# EAGLE design MySensorMicro (EAGLE 7.3.0)
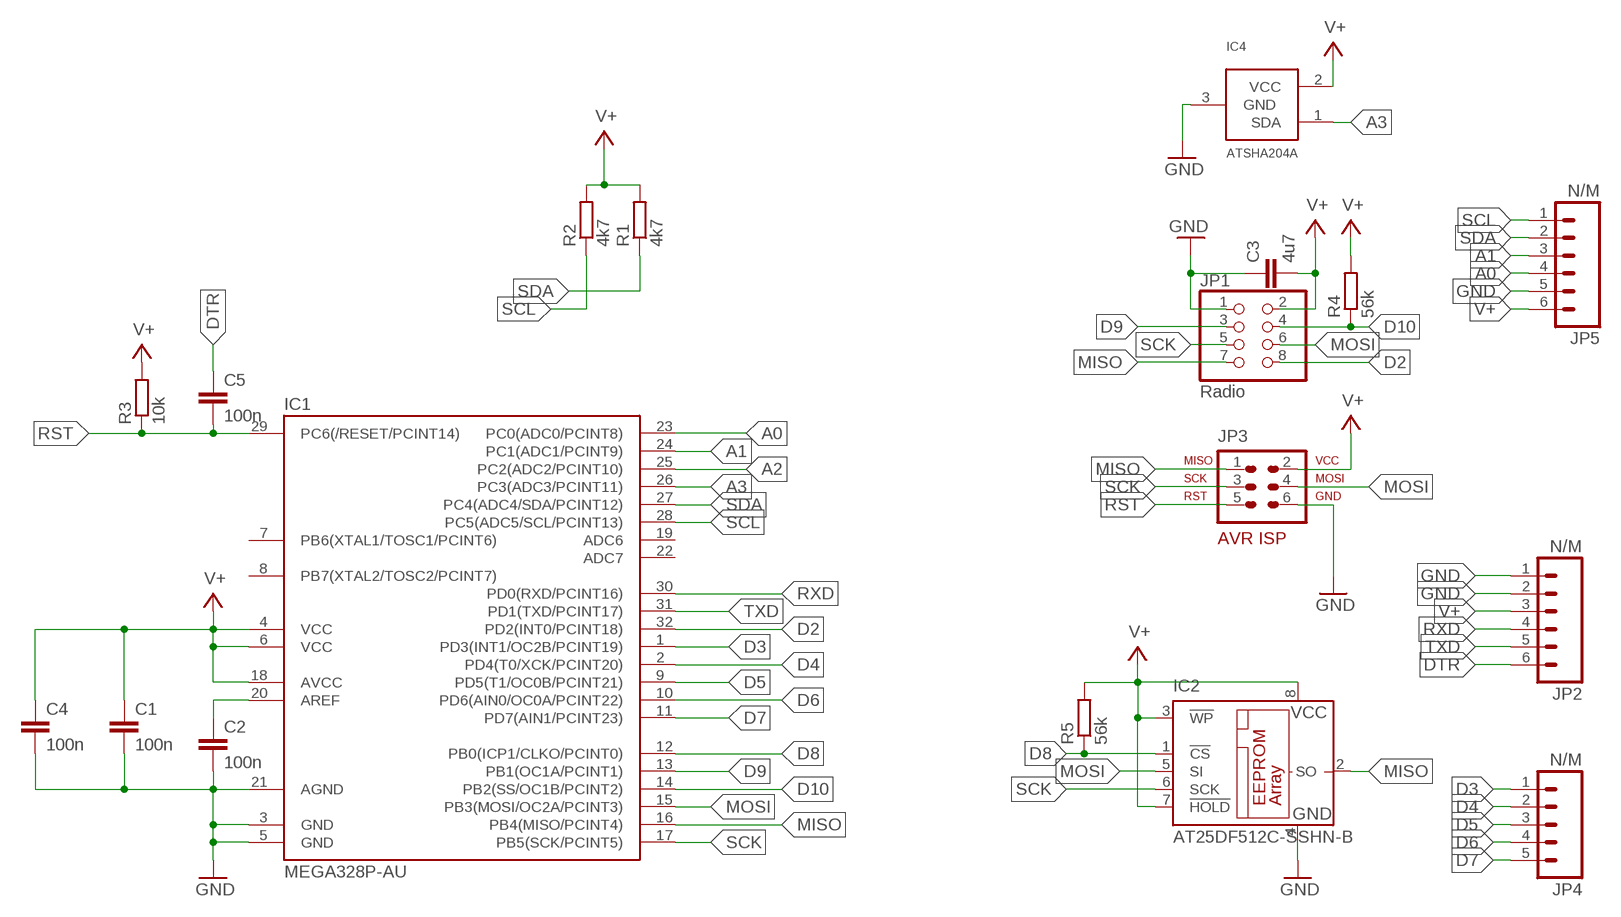
[diagram p0: schematic, sheet 1]

## Parts
C1  100n  C-EUC0603K  [C0603K]
C2  100n  C-EUC0603K  [C0603K]
C3  4u7  C-EUC0603K  [C0603K]
C4  100n  C-EUC0603K  [C0603K]
C5  100n  C-EUC0603K  [C0603K]
IC1  MEGA328P-AU  MEGA48/88/168-AU  [TQFP32-08]
IC2  AT25DF512C-SSHN-B  25AA080SN  [SO-08]
IC4  ATSHA204A  [SOT23]
JP1  Radio  PINHD-2X4  [2X04]
JP2  N/M  M06NO_SILK_FEMALE_PTH  [1X06_NO_SILK]
JP3  N/M  AVR-ISP-6VERT  [AVR-ISP-6]
JP4  N/M  M05NO_SILK  [1X05_NO_SILK]
JP5  N/M  M06NO_SILK_FEMALE_PTH  [1X06_NO_SILK]
R1  4k7  R-EU_R0603  [R0603]
R2  4k7  R-EU_R0603  [R0603]
R3  10k  R-EU_R0603  [R0603]
R4  56k  R-EU_R0603  [R0603]
R5  56k  R-EU_R0603  [R0603]

## Nets
A0: IC1.23(PC0(ADC0/PCINT8)) JP5.4
A1: IC1.24(PC1(ADC1/PCINT9)) JP5.3
A2: IC1.25(PC2(ADC2/PCINT10))
A3: IC1.26(PC3(ADC3/PCINT11)) IC4.1(SDA)
D2: IC1.32(PD2(INT0/PCINT18)) JP1.8
D3: IC1.1(PD3(INT1/OC2B/PCINT19)) JP4.1
D4: IC1.2(PD4(T0/XCK/PCINT20)) JP4.2
D5: IC1.9(PD5(T1/OC0B/PCINT21)) JP4.3
D6: IC1.10(PD6(AIN0/OC0A/PCINT22)) JP4.4
D7: IC1.11(PD7(AIN1/PCINT23)) JP4.5
D8: IC1.12(PB0(ICP1/CLKO/PCINT0)) IC2.1(!CS) R5.1
D9: IC1.13(PB1(OC1A/PCINT1)) JP1.3
D10: IC1.14(PB2(SS/OC1B/PCINT2)) JP1.4 R4.1
DTR: C5.1 JP2.6
GND [Power]: C1.2 C2.2 C3.1 C4.2 IC1.3(GND) IC1.5(GND) IC1.21(AGND) IC2.4(GND) IC4.3(GND) JP1.1 JP2.1 JP2.2 JP3.6 JP5.5
MISO: IC1.16(PB4(MISO/PCINT4)) IC2.2(SO) JP1.7 JP3.1
MOSI: IC1.15(PB3(MOSI/OC2A/PCINT3)) IC2.5(SI) JP1.6 JP3.4
N$4: C2.1 IC1.20(AREF)
RST: C5.2 IC1.29(PC6(/RESET/PCINT14)) JP3.5 R3.1
RXD: IC1.30(PD0(RXD/PCINT16)) JP2.4
SCK: IC1.17(PB5(SCK/PCINT5)) IC2.6(SCK) JP1.5 JP3.3
SCL: IC1.28(PC5(ADC5/SCL/PCINT13)) JP5.1 R2.1
SDA: IC1.27(PC4(ADC4/SDA/PCINT12)) JP5.2 R1.1
TXD: IC1.31(PD1(TXD/PCINT17)) JP2.5
V+ [Power]: C1.1 C3.2 C4.1 IC1.4(VCC) IC1.6(VCC) IC1.18(AVCC) IC2.3(!WP) IC2.7(!HOLD) IC2.8(VCC) IC4.2(VCC) JP1.2 JP2.3 JP3.2 JP5.6 R1.2 R2.2 R3.2 R4.2 R5.2
Unconnected: IC1.7(PB6(XTAL1/TOSC1/PCINT6)) IC1.8(PB7(XTAL2/TOSC2/PCINT7)) IC1.19(ADC6) IC1.22(ADC7)

## Library data of the parts
C1-C5 = resistor:C-EU: CAPACITOR, European symbol
IC1 = avr-7:MEGA48/88/168
IC2 = microchip:25*: Serial EEPROM 4K/ 8K , SPI bus; MF: MICROCHIP; MPN: 25AA080/SN; OC_FARNELL: 1816072; OC_NEWARK: 92C7351
IC4 = Sensor:ATSHA204A
JP1 = pinhead:PINHD-2X4: PIN HEADER
JP2 JP5 = SparkFun-Connectors:M06: Header 6 Standard 6-pin 0.1" header. Use with straight break away headers (SKU : PRT-00116), right angle break away headers (PRT-00553), swiss pins (PRT-00743), machine pins (PRT-00117), and female headers (PRT-00115). Molex polarized connector foot print use with SKU : PRT-08094 with associated crimp pins and housings. NOTES ON THE VARIANTS LOCK and LOCK_LONGPADS... This footprint was designed to help hold the alignment of a through-hole component (i.e. 6-pin header) while soldering it into place. You may notice that each hole has been shifted either up or down by 0.005 of an inch from it's more standard position (which is a perfectly straight line). This slight alteration caused the pins (the squares in the middle) to touch the edges of the holes. Because they are alternating, it causes a "brace" to hold the component in place. 0.005 has proven to be the perfect amount of "off-center" position when using our standard breakaway headers. Although looks a little odd when you look at the bare footprint, once you have a header in there, the alteration is very hard to notice. Also,if you push a header all the way into place, it is covered up entirely on the bottom side. This idea of altering the position of holes to aid alignment will be further integrated into the Sparkfun Library for other footprints. It can help hold any component with 3 or more connection pins.; PROD_ID: CONN-08437
JP3 = avr-7:AVR-ISP-6: AVR ISP-6 Serial Programming Header
JP4 = SparkFun-Connectors:M05: Header 5 Standard 5-pin 0.1" header. Use with straight break away headers (SKU : PRT-00116), right angle break away headers (PRT-00553), swiss pins (PRT-00743), machine pins (PRT-00117), and female headers (PRT-00115). Molex polarized connector foot print use with SKU : PRT-08230 with associated crimp pins and housings.
R1-R5 = resistor:R-EU_: RESISTOR, European symbol

## Net classes
0 default: width 0.203 mm
1 Power: width 0.406 mm

## Board
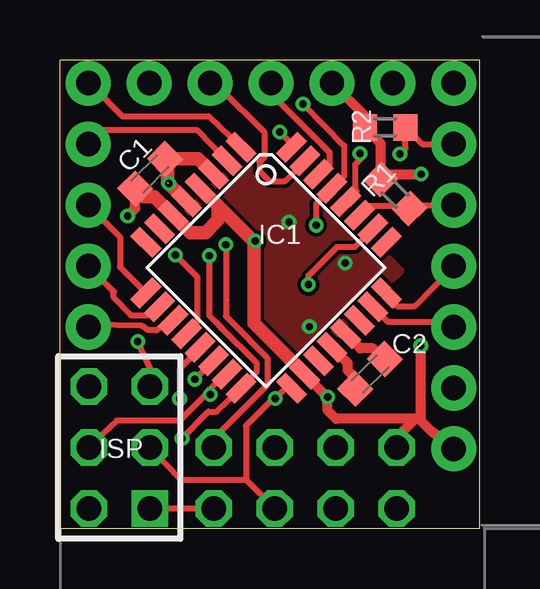
[diagram p1: board, top side]
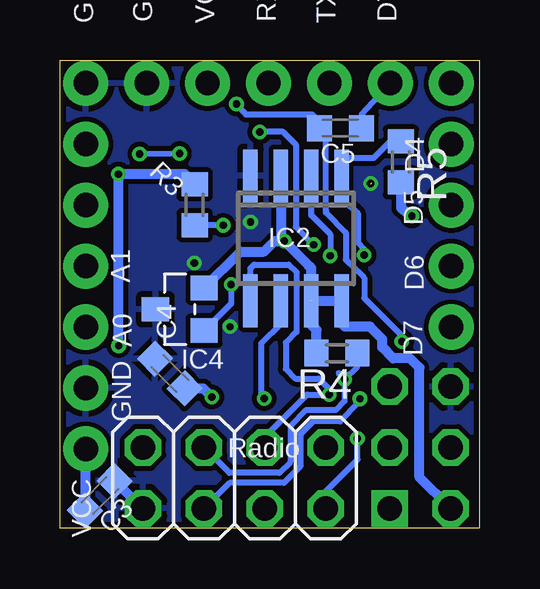
[diagram p2: board, bottom side, seen from below]

Size 17.5 x 19.5 mm. Coordinates in mm from the lower left corner, seen from the top.
Outline: 0,0 17.5,0 17.5,19.5 0,19.5 0,0
Copper layers (1*16): Top 0.035mm / dielectric 1.5mm / Bottom 0.035mm
Design rules "ITEADstudio_DRC": minimum track width 6mil, minimum drill 12mil, track to track 6mil, track to pad 6mil, pad to pad 6mil, via to via 6mil, smd to smd 0mil, copper to edge 10mil, drill to drill 10mil, minimum pad ring 10mil, minimum via ring 6mil, stop-mask expansion 2mil, vias tented up to drill 100mil, thermal gap 10mil

### Footprints (pad centres in the part's own frame; a part is rotated, then mirrored left to right if it is on the bottom)
C0603K = smd 1.05 x 1.08: 1 -0.875,0; 2 0.875,0
TQFP32-08 = smd 1.27 x 0.559: 1 -4.293,2.8; 2 -4.293,2; 3 -4.293,1.2; 4 -4.293,0.4; 5 -4.293,-0.4; 6 -4.293,-1.2; 7 -4.293,-2; 8 -4.293,-2.8; 17 4.293,-2.8; 18 4.293,-2; 19 4.293,-1.2; 20 4.293,-0.4; 21 4.293,0.4; 22 4.293,1.2; 23 4.293,2; 24 4.293,2.8 | smd 0.559 x 1.27: 9 -2.8,-4.293; 10 -2,-4.293; 11 -1.2,-4.293; 12 -0.4,-4.293; 13 0.4,-4.293; 14 1.2,-4.293; 15 2,-4.293; 16 2.8,-4.293; 25 2.8,4.293; 26 2,4.293; 27 1.2,4.293; 28 0.4,4.293; 29 -0.4,4.293; 30 -1.2,4.293; 31 -2,4.293; 32 -2.8,4.293
SO-08 = smd 0.6 x 2.2: 1 -1.905,-2.6; 2 -0.635,-2.6; 3 0.635,-2.6; 4 1.905,-2.6; 5 1.905,2.6; 6 0.635,2.6; 7 -0.635,2.6; 8 -1.905,2.6
SOT23 = smd 1.016 x 1.143: 1 -0.889,-1.016; 2 0.889,-1.016; 3 0,1.016
2X04 = drill 1.016 octagon: 1 -3.81,-1.27; 2 -3.81,1.27; 3 -1.27,-1.27; 4 -1.27,1.27; 5 1.27,-1.27; 6 1.27,1.27; 7 3.81,-1.27; 8 3.81,1.27
1X06_NO_SILK = drill 1.016 pad 1.88: 1 0,0; 2 2.54,0; 3 5.08,0; 4 7.62,0; 5 10.16,0; 6 12.7,0
AVR-ISP-6 = drill 1.016 square: 1 -2.54,-1.27 | drill 1.016 octagon: 2 -2.54,1.27; 3 0,-1.27; 4 0,1.27; 5 2.54,-1.27; 6 2.54,1.27
1X05_NO_SILK = drill 1.016 pad 1.88: 1 0,0; 2 2.54,0; 3 5.08,0; 4 7.62,0; 5 10.16,0
R0603 = smd 1 x 1.1: 1 -0.85,0; 2 0.85,0

### Placement (x,y rotation side)
C1  3.76,14.76 45 top
C2  12.93,6.42 45 top
C3  15.84,1.35 225 bottom
C4  12.92,6.44 135 bottom
C5  5.8,16.66 180 bottom
IC1  8.6,10.85 315 top
IC2  7.65,12.07 180 bottom
IC4  12.5,9.12 90 bottom
JP1  10.22,2.08 0 bottom
JP2  16.42,18.53 180 top
JP3  2.48,3.35 90 top
JP4  1.18,18.53 270 top
JP5  16.42,15.99 270 top
R1  13.98,13.92 135 top
R2  13.56,16.69 180 top
R3  11.88,13.47 90 bottom
R4  5.95,7.28 180 bottom
R5  3.28,15.25 270 bottom

### Tracks (layer width: path | path; a pad name or v marks a point on that pad's centre or on a via)
A0
  Top 0.254: IC1.23 13.05,9.22 13.68,8.59 15.86,8.59 JP5.4
A1
  Top 0.254: IC1.24 13.89,9.46 14.06,9.25 14.8,9.25 JP5.3
A3  (via drill 0.3)
  Top 0.254: IC1.26 12.3,11.71 11.76,11.7 11.55,11.7 10.36,10.51 v10.36,10.14
  Bottom 0.254: v10.36,10.14 10.36,9.35 IC4.1
D2  (via drill 0.3, 0.3 pad 0.61)
  Top 0.254: JP1.8 6.44,3.35 6.44,3.76 8.65,5.98 8.65,7.08 7.12,8.62 6.92,8.83 v6.92,11.81 | IC1.32 9.71,15.95 v9.16,16.51
  Bottom 0.254: v9.16,16.51 8.19,16.51 7.66,15.98 7.66,12.54 v6.92,11.81
D3
  Top 0.254: JP4.1 1.41,18.36 2.59,17.16 6.19,17.16 IC1.1
D4
  Top 0.254: JP4.2 1.28,16 0.85,16.59 5.71,16.59 IC1.2
D5
  Top 0.254: JP4.3 1.16,13.46 2.5,12.12 2.5,10.87 IC1.9
D6
  Top 0.254: IC1.10 3.95,9.23 3.6,8.84 2.97,8.84 2.25,9.6 2.25,9.85 JP4.4
D7
  Top 0.254: IC1.11 4.02,8.24 3.67,8.24 3.42,8.42 1.28,8.48 JP4.5
D8  (via drill 0.3 pad 0.61)
  Top 0.254: IC1.12 5.28,8.14 5.73,8.59 5.73,10.46 4.76,11.43 v4.81,11.38
  Bottom 0.254: IC2.1 5.74,13.88 | IC2.1 5.77,13.88 5.79,13.78 5.21,13.25 5.08,13.12 5.08,11.9 4.81,11.63 v4.81,11.38 | IC2.1 5.75,15.4 5.76,15.41 4.42,15.41 3.72,16.11 R5.1
D9  (via drill 0.3)
  Top 0.254: IC1.13 5.85,7.49 4.99,6.63 v4.99,5.39
  Bottom 0.254: v4.99,5.39 5.04,5.21 5.8,4.45 6.92,4.45 7.48,3.9 7.48,2.57 8.17,1.88 10.42,1.88 JP1.3
D10  (via drill 0.3)
  Top 0.254: IC1.14 6.39,6.96 v5.63,6.2
  Bottom 0.254: v5.63,6.2 5.63,5.29 5.99,4.91 7.24,4.91 7.89,4.25 7.89,2.74 8.34,2.3 10.43,2.29 JP1.4 | 5.88,6.46 v5.63,6.2 | R4.1 5.1,6.73 v5.63,6.2
DTR
  Bottom 0.254: JP2.6 4.93,17.22 C5.1
GND  (via drill 0.3, 0.3 pad 0.61)  (1 unrouted)
  Top 0.406: C2.2 13.45,7.09 13.06,7.49 12.53,7.49 IC1.21
  Top 0.559: IC1.5 4.5,14.38 4.5,14.88 4.38,15 C1.2 5.77,15.38 IC1.3
  Bottom 0.406: C3.1 14.07,0.81 JP1.1
  other vias: 9.55,12.75 10.41,8.39 11.9,11.04 4.54,14.35
  pour Bottom (isolate 0.203): 0.04,19.25 17.56,19.25 17.66,-0.79 0.16,-0.71
  pour Top: 14.29,10.72 8.65,16.54 3.7,11.58 2.98,11 8.47,5.11
MISO  (via drill 0.3, 0.3 pad 0.61)
  Top 0.254: 6.63,8.44 6.75,8.33 8.19,6.88 8.19,6.48 IC1.16 6.54,4.85 6.18,4.85 v5.09,3.73 | JP3.1 JP1.7 | 6.63,8.44 6.48,8.6 | v6.23,11.34 6.23,8.85 6.63,8.44
  Bottom 0.254: JP1.7 6.41,1.53 5.09,2.85 v5.09,3.73 | v6.23,11.34 6.23,11.47 6.23,12.24 7.02,13.03 IC2.2
MOSI  (via drill 0.3)
  Top 0.254: JP3.4 2.38,4.47 4.99,4.47 6.05,5.54 v6.27,5.56 6.24,5.77 6.87,6.4 IC1.15
  Bottom 0.203: v6.27,5.56
  Bottom 0.254: v6.27,5.56 6.24,5.77 6.7,6.23 7.67,6.23 8.08,6.63 8.08,7.73 7.63,8.17 7.63,10.65 7.96,10.98 9.4,10.98 9.56,10.82 IC2.5 | 6.37,5.47 v6.27,5.56 | JP1.6 8.95,3.81 7.2,5.56 v6.27,5.56
N$4
  Top 0.406: C2.1 12.31,6.25 12.01,6.55 12.01,6.87 IC1.20
RST  (via drill 0.3, 0.3 pad 0.61)
  Top 0.254: v10.14,17.67 11.85,15.93 11.85,14.66 IC1.29 10.68,13.5 v10.68,12.62 | v3.24,7.76 3.75,6.69 JP3.5
  Bottom 0.254: v10.14,17.67 10.12,17.61 9.75,17.24 6.99,17.24 6.41,16.66 | 6.41,16.66 6.41,15.57 6.41,13.25 6.41,13.15 5.58,12.31 5.58,11.19 5.4,11.01 4.81,10.42 4.81,9.58 3.24,8.01 v3.24,7.76 | 6.41,16.66 C5.2 | v10.68,12.62 v10.69,12.62 R3.1
RXD
  Top 0.254: JP2.4 8.78,18.11 11.24,15.65 11.24,15.19 IC1.30
SCK  (via drill 0.3)
  Top 0.254: JP3.3 5.04,2.01 7.76,2.01 | 7.76,2.01 JP1.5 | IC1.17 9.41,5.83 v8.98,5.4 8.9,5.4 7.76,4.25 7.76,2.01
  Bottom 0.254: IC2.6 8.29,8.52 9.11,7.69 9.11,5.4 v8.98,5.4
SCL  (via drill 0.3 pad 0.61)
  Top 0.254: R2.1 15.11,15.99 JP5.1 | IC1.28 12.38,14.03 12.32,14.09 12.32,15.15 12.63,15.46 v12.51,15.6 | 14.41,16.57 R2.1 | v14.18,15.58 14.41,15.81 R2.1
  Bottom 0.254: v12.51,15.6 12.71,15.59 v14.18,15.58
SDA
  Top 0.254: 12.13,12.7 IC1.27 12.88,13.43 13.87,13.43 13.98,13.31 R1.1 14.71,13.45 JP5.2
TXD
  Top 0.254: JP2.5 6.72,18.29 8.52,16.49 8.52,15.45 8.32,15.25 8.32,14.86 8.74,14.45 9.38,14.45 IC1.31
V+  (via drill 0.3, 0.3 pad 0.61)  (1 unrouted)
  Top 0.406: 10.22,6.38 IC1.18 v11.16,5.45 11.16,4.9 11.52,4.55 14.81,4.55 | JP5.6 15.51,4.01 14.97,4.55 14.95,4.55 | 14.95,4.55 14.81,4.55 | 14.95,4.55 15.05,4.6 v15.05,7.6 | JP1.2 14.03,3.77 14.81,4.55 | v15.06,14.74 13.6,14.74 R1.2 13.37,16.02 R2.2 12.71,17.17 JP2.3 | v2.83,13 3.14,13.31 C1.1
  Top 0.559: C1.1 3.48,13.8 3.93,13.8 4.69,13.03 IC1.6 5.44,12.31 6.07,12.31 6.59,12.84 6.59,13.43 | 6.59,13.43 5.86,14.16 IC1.4 | IC1.18 8.09,8.53 8.09,11.9 v8.15,11.96 8.07,11.96 6.59,13.43
  Bottom 0.406: v15.05,7.6 v15.06,14.74 12.3,14.74 R3.2 | C4.1 11.53,5.82 v11.16,5.45 | 8.32,14.63 IC2.3 8.29,12.1 v8.15,11.96 8.55,11.96 8.99,11.52 9.98,11.52 IC4.2 | C3.2 16.42,0.77 JP5.6 | 6.99,9.5 6.99,10.23 7.03,10.26 7.03,10.83 7.12,10.93 8.11,11.92 | JP3.2 2.5,2.11 2.5,6.68 2.9,7.07 3.61,7.07 4.05,7.52 4.05,7.88 4.57,8.39 5.62,8.39 5.79,8.56 5.79,9.43 IC2.8 IC2.7 7.07,9.42 7.07,8.52 6.8,8.24 R4.2 | R5.2 3.28,13.34 v2.83,13
  Bottom 0.559: v8.15,11.96 8.11,11.92

### Text on the board
bPlace: D4 | D5 | A1 | D6 | D7 | A0 | GND | VCC
tNames: ISP
bNames: DTR | TXD | RXD | VCC | GND | GND | Radio